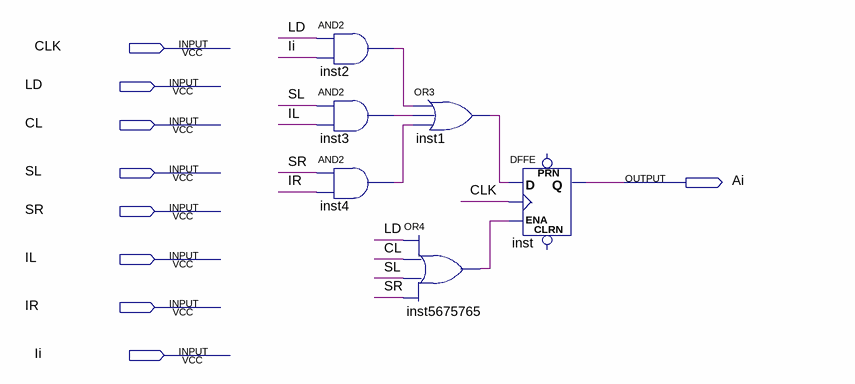
[diagram p0: schematic sheet]
// Quartus schematic REG1_LD_SL_SR_CL.bdf as structural Verilog: 6 symbols, 9 pins
module REG1_LD_SL_SR_CL (
  input  CLK,
  input  LD,
  input  CL,
  input  SL,
  input  SR,
  input  IL,
  input  IR,
  input  Ii,
  output Ai
);

  wire inst1_out, inst2_out, inst3_out, inst4_out, inst5675765_out;

  and inst2 (inst2_out, LD, Ii);
  and inst3 (inst3_out, SL, IL);
  and inst4 (inst4_out, SR, IR);
  or inst5675765 (inst5675765_out, LD, CL, SL, SR);
  or inst1 (inst1_out, inst2_out, inst3_out, inst4_out);
  DFFE inst (.D(inst1_out), .CLK(CLK), .ENA(inst5675765_out), .Q(Ai));  // open: PRN, CLRN
endmodule
